# Altium project ESP8266-Deskop_Power.PrjPcb (part 1 of 2)
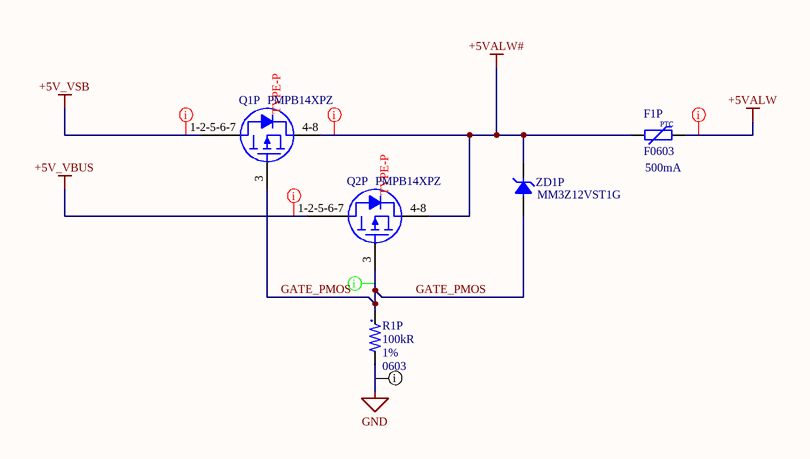
[diagram p0: 1_Power_Path.SchDoc]
10 sheets, 64 parts. Net scope: flat (ports and power ports of the same name join across sheets).
Board file: ESP8266-Deskop_Power.PcbDoc
Sheets:
  1_Power_Path.SchDoc
  2_LDO.SchDoc
  3_ESP8266_Core.SchDoc
  4_UART.SchDoc
  5_Keys_And_Status.SchDoc
  6_I2C_Sensors.SchDoc
  7_Mosfets.SchDoc
  8_Front_Pannel_Con.SchDoc
  9_Front_Pannel_USB_Con.SchDoc
  10_MountingHoles.SchDoc

## Sheet 1_Power_Path.SchDoc: Power_Path
size A4; ApprovedBy: Alcatraz; CheckedBy: Alcatraz; Author: Alcatraz; CompanyName: DHNLAB; DrawnBy: Alcatraz; Engineer: Alcatraz; Organization: DHNLAB PVT LTD; Address1: DHANBAD; Address2: JHARKHAND; Address3: INDIA; Address4: ASIA; DocumentNumber: 1; Revision: 1.0; SheetNumber: 1; SheetTotal: 10; ProjectTitle: ESP8266-Deskop_Power

### Parts
F1P  F0603  value 500mA  [R0603-IPC_C]
Q1P  PMPB14XPZ  [DFN2020MD-MFG]
Q2P  PMPB14XPZ  [DFN2020MD-MFG]
R1P  value 100kR  Tolerance: 1%  Case/Package: 0603  [R0603-MFG]  (hidden comment: AC0603FR-07100KL)
ZD1P  MM3Z12VST1G  [SOD-323]

### Nets
+5V_VBUS: Q2P.1-2-5-6-7(D)
+5V_VSB: Q1P.1-2-5-6-7(D)
+5VALW: F1P.2
+5VALW#: F1P.1 Q1P.4-8(S) Q2P.4-8(S) ZD1P.1(C)
GND: R1P.2
GATE_PMOS: Q1P.3(G) Q2P.3(G) R1P.1 ZD1P.2(A)

### Layout directives
net class Power; net class PowerRails_LowVoltage_DC: +5V_VBUS, +5V_VSB, +5VALW, +5VALW#
net class Digital_Signal_Low_Speed; net class Signal: GATE_PMOS
net class GND; net class PowerRails_GND: GND

### Notes on the sheet
- Title:
- Author:
- Approved:
- Size:
- Date:
- Git Hash:
- A4
- Prj:
- SW Version:
- Variant:
- Edited:
- PUBLIC
- File:
- (in symbol FUSE_PPTC_0603) PTC
- (in symbol PMPB14XPZ) TYPE-P

### Library data of the parts
F1P = FUSE_PPTC_0603: Fuse PPTC SMD 0603; Manufacturer: *; Manufacturer Part Number: *
Q1P Q2P = PMPB14XPZ: Manufacturer: Nexperia; Supplier 1: Element14; Supplier Part Number 1: 4177131; Manufacturer Part Number: PMPB14XPZ; RoHS: No; Stock 1: 3000
R1P = 100K: SMD Chip Resistor, 100 kOhm, ± 1%, 100 mW, 0603 [1608 Metric], Thick Film, General Purpose; Manufacturer: Yageo; Power Rating: 100mW; Temperature Coefficient: 100ppm/°C; Voltage Rating: 50V; Working Voltage: 75V; Supplier 1: Future Electronics; Manufacturer Part Number: AC0603FR-07100KL; RoHS: Yes; Category: Chip SMD Resistors; Stock 1: 3790000; Pricing 1: 5000=0.0034, 25000=0.0018, 75000=0.0032, 125000=0.0017, 250000=0.0031, 750000=0.003, 2500000=0.0027 (USD); Case Code (Imperial): 0603; Case Code (Metric): 1608; Min Operating Temperature: -55°C; Max Operating Temperature: 155°C; Packaging: Tape and Reel; Series: AC; Termination: SMD/SMT; Construction: Rectangular; Length: 1.6mm; Depth: 0.8mm; RoHS Compliant: Yes; Military Standard: Not; Lead Free: 5697LeadFree; Supplier Part Number 1: 6029288; Max Power Dissipation: 100mW; Features: Moisture Resistant,Automotive AEC-Q200; Number of Terminations: 2; Technology: THICK FILM; Moisture Sensitivity Level: 1; Ratings: AEC-Q200; ComponentLink1URL: https://datasheet.ciiva.com/26862/getdatasheetpartid-715379-26862460.pdf?src-supplier=Verical; ComponentLink1Description: https://datasheet.ciiva.com/26862/getdatasheetpartid-715379-26862460.pdf?src-supplier=Verical; ComponentLink2URL: https://datasheet.ciiva.com/5562/pyu-ac-51-rohs-l-2-5562536.pdf?src-supplier=Mouser; ComponentLink2Description: https://datasheet.ciiva.com/5562/pyu-ac-51-rohs-l-2-5562536.pdf?src-supplier=Mouser
ZD1P = MM3Z12VST1G: MM3Z12VST1G Zener Diode, 12V 2% 200 mW SMT 2-Pin SOD-323 | ON Semiconductor MM3Z12VST1G; Max Power Dissipation: 300mW; Impedance: 25R; Power Dissipation: 200mW; Max Reverse Leakage Current: 100nA; Test Current: 5mA; Forward Voltage: 900mV; Zener Current: 10mA; Supplier 1: Onlinecomponents.com; Supplier Part Number 1: MM3Z12VST1G; Manufacturer: ON Semiconductor; Manufacturer Part Number: MM3Z12VST1G; RoHS: Yes; Category: Zener Diodes; Stock 1: 60000; Pricing 1: 3000=0.0152, 6000=0.0145, 9000=0.0143, 27000=0.0137, 51000=0.0133, 102000=0.0128, 252000=0.0125, 501000=0.0123 (USD); Case/Package: SOD-323-2; Min Operating Temperature: -65°C; Max Operating Temperature: 150°C; Packaging: Tape and Reel; Package Quantity: 3000; Zener Voltage: 12V; Voltage Tolerance: 2%; Tolerance: 2%; Series: -; RoHS Compliant: Yes; ComponentLink1URL: https://datasheet.ciiva.com/30478/0900766b8127c8bd-30478408.pdf?src-supplier=Rs; ComponentLink1Description: https://datasheet.ciiva.com/30478/0900766b8127c8bd-30478408.pdf?src-supplier=Rs; ComponentLink2URL: https://datasheet.ciiva.com/16292/mm3z12vst1g-16292931.pdf?src-supplier=Future+Electronics; ComponentLink2Description: https://datasheet.ciiva.com/16292/mm3z12vst1g-16292931.pdf?src-supplier=Future+Electronics; ComponentLink3URL: https://datasheet.ciiva.com/22626/1878251-22626885.pdf?src-supplier=Element14; ComponentLink3Description: https://datasheet.ciiva.com/22626/1878251-22626885.pdf?src-supplier=Element14; Pins: 2; Material: Plastic; Working Voltage: 12V; Max Reverse Current: 100nA; Voltage Rating (DC): 12V; Power Rating: 200mW; Length: 1.8mm; Width: 1.35mm; Height: 1mm; Radiation Hardening: No; Lead Free: Lead Free; Reach SVHC Compliant: No; ComponentLink4URL: https://datasheet.ciiva.com/894/mm3z2v4st1-d-894650.pdf?src-supplier=Digikey; ComponentLink4Description: https://datasheet.ciiva.com/894/mm3z2v4st1-d-894650.pdf?src-supplier=Digikey; ComponentLink5URL: https://datasheet.ciiva.com/894/mm3z2v4st1-d-894651.pdf?src-supplier=Digikey; ComponentLink5Description: https://datasheet.ciiva.com/894/mm3z2v4st1-d-894651.pdf?src-supplier=Digikey; ComponentLink6URL: https://datasheet.ciiva.com/894/mm3z2v4st1-d-894649.pdf?src-supplier=Digikey; ComponentLink6Description: https://datasheet.ciiva.com/894/mm3z2v4st1-d-894649.pdf?src-supplier=Digikey

## Sheet 2_LDO.SchDoc: LDO
size A4; ApprovedBy: Alcatraz; CheckedBy: Alcatraz; Author: Alcatraz; CompanyName: DHNLAB; DrawnBy: Alcatraz; Engineer: Alcatraz; Organization: DHNLAB PVT LTD; Address1: DHANBAD; Address2: JHARKHAND; Address3: INDIA; Address4: ASIA; DocumentNumber: 2; Revision: 1.0; SheetNumber: 2; SheetTotal: 10; ProjectTitle: ESP8266-Deskop_Power
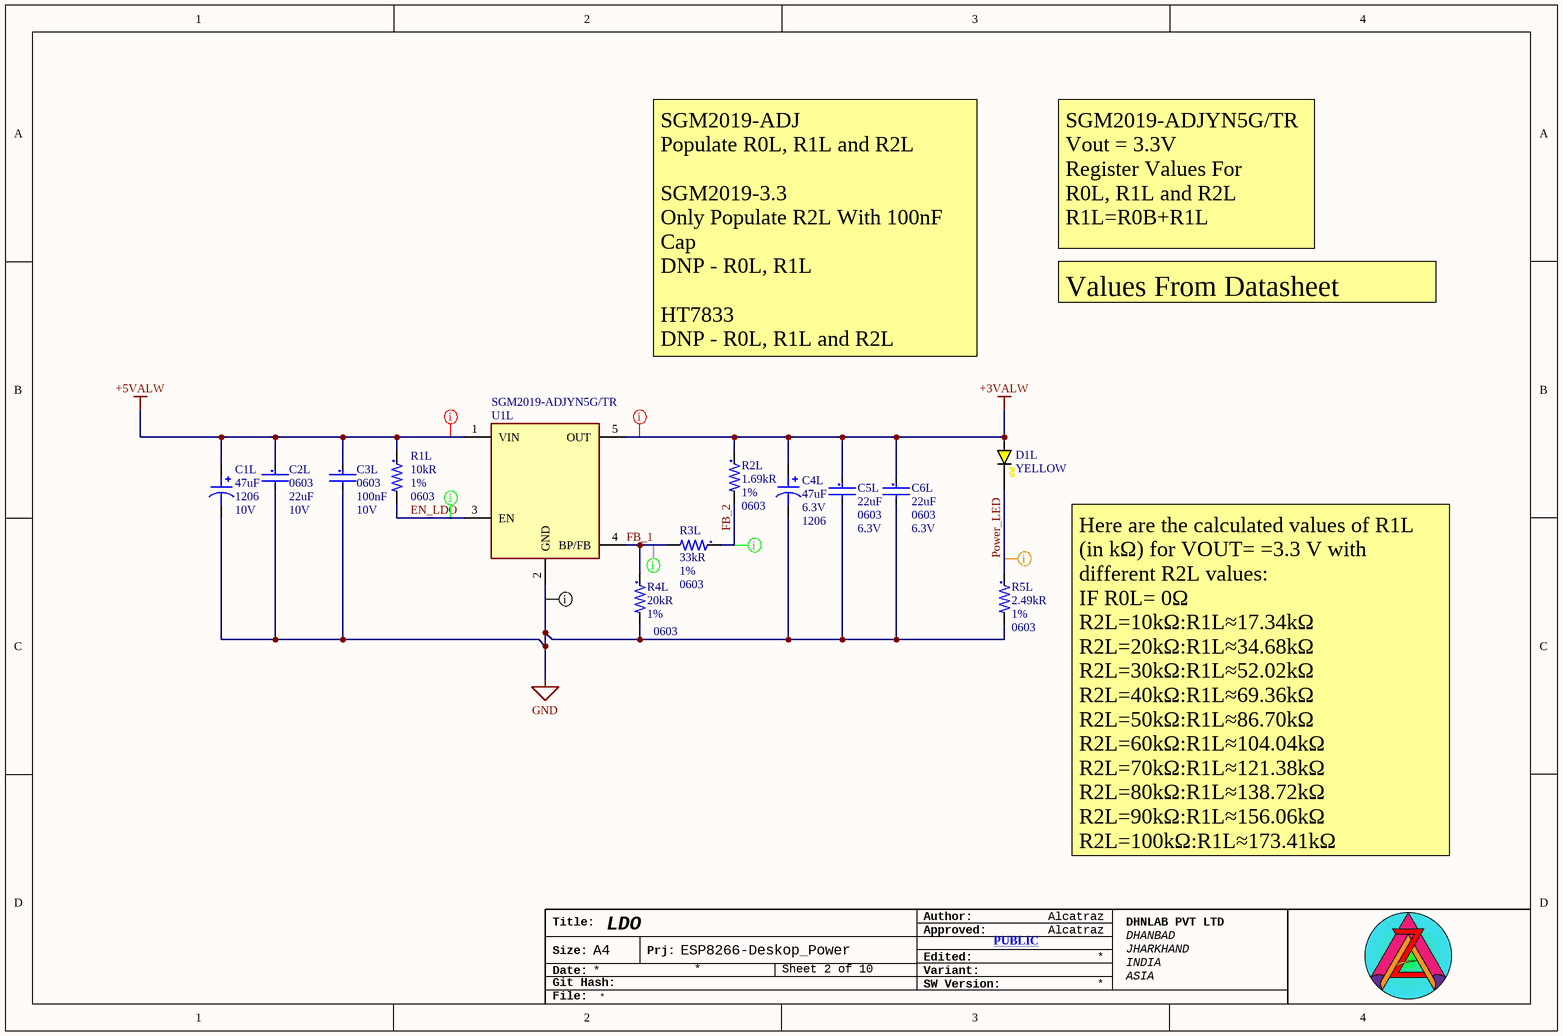
[diagram p1: 2_LDO.SchDoc]

### Parts
C1L  value 47uF  Case/Package: 1206  Voltage Rating (DC): 10V  [CAP POL 1206_3216-MFG]  (hidden comment: TCTAL1A476M8R)
C2L  value 22uF  Case/Package: 0603  Voltage Rating: 10V  [C0603-IPC_C_No_Silk]  (hidden comment: GRM188R61A226ME15D)
C3L  value 100nF  Case/Package: 0603  Voltage Rating: 10V  [C0603-IPC_C_No_Silk]  (hidden comment: C0603C104K8RACTU)
C4L  value 47uF  Voltage: 6.3V  Size: 1206  [CAP POL 1206_3216-MFG]  (hidden comment: T491A476M006AT)
C5L  value 22uF  Case/Package: 0603  Voltage Rating: 6.3V  [C0603-IPC_C_No_Silk]  (hidden comment: GRM188R60J226MEA0D)
C6L  value 22uF  Case/Package: 0603  Voltage Rating: 6.3V  [C0603-IPC_C_No_Silk]  (hidden comment: GRM188R60J226MEA0D)
D1L  YELLOW  [LED_0603_YELLOW]
R1L  value 10kR  Tolerance: 1%  Case/Package: 0603  [R0603-MFG]  (hidden comment: RC0603FR-0710KL)
R2L  value 1.69kR  Tolerance: 1%  Case/Package: 0603  [R0603-MFG]  (hidden comment: MCR03EZPFX1691)
R3L  value 33kR  Tolerance: 1%  Case/Package: 0603  [R0603-MFG]  (hidden comment: ERJ-3EKF3302V)
R4L  value 20kR  Tolerance: 1%  Case/Package: 0603  [R0603-MFG]  (hidden comment: CR0603-FX-2002ELF)
R5L  value 2.49kR  Tolerance: 1%  Case/Package: 0603  [R0603-MFG]  (hidden comment: MCR03EZPFX2491)
U1L  SGM2019-ADJYN5G/TR  [TSOT-23-5-IPC-A]

### Nets
+3VALW: C4L.1 C5L.1 C6L.1 D1L.2(A) R2L.1 U1L.5(OUT)
+5VALW: C1L.1 C2L.1 C3L.1 R1L.1 U1L.1(VIN)
GND: C1L.2 C2L.2 C3L.2 C4L.2 C5L.2 C6L.2 R4L.2 R5L.2 U1L.2(GND)
EN_LDO: R1L.2 U1L.3(EN)
FB_1: R3L.2 R4L.1 U1L.4(BP/FB)
FB_2: R2L.2 R3L.1
Power_LED: D1L.1(K) R5L.1

### Layout directives
net class GND; net class PowerRails_GND: GND
net class Power; net class PowerRails_LowVoltage_DC; net class Power_Signal: Power_LED
net class Digital_Signal_Low_Speed; net class Signal: EN_LDO, FB_1, FB_2
net class Power; net class PowerRails_LowVoltage_DC: +3VALW, +5VALW

### Notes on the sheet
- SGM2019-ADJYN5G/TR
  Vout = 3.3V
  Register Values For
  R0L, R1L and R2L
  R1L=R0B+R1L
- Values From Datasheet
- SGM2019-ADJ
  Populate R0L, R1L and R2L
  SGM2019-3.3
  Only Populate R2L With 100nF Cap
  DNP - R0L, R1L
  HT7833
  DNP - R0L, R1L and R2L
- Here are the calculated values of R1L (in kΩ) for VOUT= =3.3 V with different R2L values:
  IF R0L= 0Ω
  R2L=10kΩ:R1L≈17.34kΩ
  R2L=20kΩ:R1L≈34.68kΩ
  R2L=30kΩ:R1L≈52.02kΩ
  R2L=40kΩ:R1L≈69.36kΩ
  R2L=50kΩ:R1L≈86.70kΩ
  R2L=60kΩ:R1L≈104.04kΩ
  R2L=70kΩ:R1L≈121.38kΩ
  R2L=80kΩ:R1L≈138.72kΩ
  R2L=90kΩ:R1L≈156.06kΩ
  R2L=100kΩ:R1L≈173.41kΩ
- Title:
- Author:
- Approved:
- Size:
- Date:
- Git Hash:
- A4
- Prj:
- SW Version:
- Variant:
- Edited:
- PUBLIC
- File:

### Library data of the parts
C1L = 47uF_10V: Surface Mount Tantalum Capacitor, 47 uF, 10 V, ± 20%, -55 °C, 125 °C, 1206 [3216-12 Metric]; Manufacturer: Rohm; Supplier 1: Ameya360; RoHS: Yes; Category: Tantalum Capacitors; ComponentLink1URL: https://datasheet.ciiva.com/258/tct-al-258880.pdf?src-supplier=Digikey; ComponentLink1Description: https://datasheet.ciiva.com/258/tct-al-258880.pdf?src-supplier=Digikey; ComponentLink2URL: https://datasheet.ciiva.com/258/tct-al-258881.pdf?src-supplier=Digikey; ComponentLink2Description: https://datasheet.ciiva.com/258/tct-al-258881.pdf?src-supplier=Digikey; ComponentLink3URL: https://datasheet.ciiva.com/258/tct-al-258879.pdf?src-supplier=Digikey; ComponentLink3Description: https://datasheet.ciiva.com/258/tct-al-258879.pdf?src-supplier=Digikey; ComponentLink4URL: https://datasheet.ciiva.com/16394/tct-al-16394319.pdf?src-supplier=Future+Electronics; ComponentLink4Description: https://datasheet.ciiva.com/16394/tct-al-16394319.pdf?src-supplier=Future+Electronics; Manufacturer Part Number: TCTAL1A476M8R; Stock 1: 250; Pricing 1: 1=0.82, 10=0.622 (USD); Supplier Part Number 1: TCTAL1A476M8R; Mounting Technology: Surface Mount; Case Code (Metric): 3216; Case Code (Imperial): 1206; Min Operating Temperature: -55°C; Max Operating Temperature: 125°C; Tolerance: 20%; Packaging: Cut Tape; Voltage Rating: 10V; Series: TCT; Features: General Purpose; Construction: Flat; Length: 3.2mm; Height: 1.1mm; Depth: 1.6mm; Radiation Hardening: No; RoHS Compliant: Yes; Lead Free: Lead Free
C2L = 22uF_10V: Multilayer Ceramic Capacitor, 22 uF, 10 V, ± 20%, X5R, 0603 [1608 Metric]; Manufacturer: Murata; Supplier 1: Mouser; Manufacturer Part Number: GRM188R61A226ME15D; RoHS: Yes; Category: Ceramic Capacitors; Pricing 1: 1=0.2, 10=0.088, 50=0.088, 100=0.051, 1000=0.041, 10000=0.037 (USD); Mounting Technology: Surface Mount; Case Code (Imperial): 0603; Case Code (Metric): 1608; Min Operating Temperature: -55°C; Max Operating Temperature: 85°C; Packaging: Cut Tape; Dielectric: X5R; Package Quantity: 4000; Series: GRM; Termination: SMD/SMT; Voltage Rating (DC): 10V; Length: 1.6mm; Width: 0.8mm; Height: 0.8mm; RoHS Compliant: Yes; Lead Free: 5697LeadFree; ComponentLink1URL: https://datasheet.ciiva.com/46444/1769893-46444975.pdf?src-supplier=Element14; ComponentLink1Description: https://datasheet.ciiva.com/46444/1769893-46444975.pdf?src-supplier=Element14; Supplier Part Number 1: 81-GRM188R61A226ME5D; Tolerance: 20%; Stock 1: 596743; Material: Ceramic; Weight: 0.000222oz; Thickness: 0.039inch; Reach SVHC Compliant: No
C3L = 100nF_10V: Multilayer Ceramic Capacitor, 0.1 uF, 10 V, ± 10%, X7R, 0603 [1608 Metric]; Manufacturer: KEMET; Material: 4241ConductorMaterial; Dissipation Factor: 5%; Temperature Coefficient: 30ppm/°C; Supplier 1: Mouser; Manufacturer Part Number: C0603C104K8RACTU; RoHS: Yes; Category: Ceramic Capacitors; Pricing 1: 1=0.11, 10=0.075, 50=0.075, 100=0.036, 1000=0.021, 10000=0.017 (USD); Mounting Technology: Surface Mount,PCB; Case Code (Imperial): 0603; Case Code (Metric): 1608; Min Operating Temperature: -55°C; Max Operating Temperature: 125°C; Packaging: Tape and Reel; Dielectric: X7R; Package Quantity: 1; Series: C; Termination: SMD/SMT; Voltage Rating (DC): 10V; Length: 1.6mm; Width: 0.031inch; Height: 0.8mm; RoHS Compliant: Yes; Lead Free: 5697LeadFree; ComponentLink1URL: https://datasheet.ciiva.com/6093/1776114-6093269.pdf?src-supplier=Farnell; ComponentLink1Description: https://datasheet.ciiva.com/6093/1776114-6093269.pdf?src-supplier=Farnell; Supplier Part Number 1: 80-C0603C104K8R; Tolerance: 10%; Stock 1: 246409; Thickness: 0.034inch; Reach SVHC Compliant: No; Pins: 2; Dielectric Material: Ceramic; Voltage: 10V; Construction: Flat; Depth: 0.8mm; ComponentLink2URL: https://datasheet.ciiva.com/7823/kem-c1002-x7r-smd-7823989.pdf?src-supplier=Element14; ComponentLink2Description: https://datasheet.ciiva.com/7823/kem-c1002-x7r-smd-7823989.pdf?src-supplier=Element14; ComponentLink3URL: https://datasheet.ciiva.com/22693/1851736-22693967.pdf?src-supplier=Element14; ComponentLink3Description: https://datasheet.ciiva.com/22693/1851736-22693967.pdf?src-supplier=Element14; ComponentLink4URL: https://datasheet.ciiva.com/14589/70095383-14589402.pdf?src-supplier=Allied+Electronics; ComponentLink4Description: https://datasheet.ciiva.com/14589/70095383-14589402.pdf?src-supplier=Allied+Electronics; ComponentLink5URL: https://datasheet.ciiva.com/14593/70095383-14593978.pdf?src-supplier=Allied+Electronics; ComponentLink5Description: https://datasheet.ciiva.com/14593/70095383-14593978.pdf?src-supplier=Allied+Electronics; ComponentLink6URL: https://datasheet.ciiva.com/5419/kem-c1002-x7r-smd-357932-5419657.pdf?src-supplier=Mouser; ComponentLink6Description: https://datasheet.ciiva.com/5419/kem-c1002-x7r-smd-357932-5419657.pdf?src-supplier=Mouser; ComponentLink7URL: https://datasheet.ciiva.com/18192/getdatasheetpartid-91529-18192711.pdf?src-supplier=Verical; ComponentLink7Description: https://datasheet.ciiva.com/18192/getdatasheetpartid-91529-18192711.pdf?src-supplier=Verical; Lead Pitch: 0.7mm; Radiation Hardening: No
C4L = 47uF_6.3V: 47uF Solid MnO2 Tantalum Electrolytic Capacitor; 6.3 V dc +/-20%; T491 Series; Manufacturer: KEMET; Supplier 1: Mouser; RoHS: Yes; Category: Tantalum Capacitors; ComponentLink1URL: https://datasheet.ciiva.com/18096/getdatasheetpartid-132583-18096186.pdf?src-supplier=Verical; ComponentLink1Description: https://datasheet.ciiva.com/18096/getdatasheetpartid-132583-18096186.pdf?src-supplier=Verical; ComponentLink2URL: https://datasheet.ciiva.com/258/kem-t2005-t491-258163.pdf?src-supplier=Digikey; ComponentLink2Description: https://datasheet.ciiva.com/258/kem-t2005-t491-258163.pdf?src-supplier=Digikey; ComponentLink3URL: https://datasheet.ciiva.com/258/kem-t2005-t491-258164.pdf?src-supplier=Digikey; ComponentLink3Description: https://datasheet.ciiva.com/258/kem-t2005-t491-258164.pdf?src-supplier=Digikey; ComponentLink4URL: https://datasheet.ciiva.com/258/kem-t2005-t491-258165.pdf?src-supplier=Digikey; ComponentLink4Description: https://datasheet.ciiva.com/258/kem-t2005-t491-258165.pdf?src-supplier=Digikey; ComponentLink5URL: https://datasheet.ciiva.com/12883/kem-t2005-t491-12883464.pdf?src-supplier=Mouser; ComponentLink5Description: https://datasheet.ciiva.com/12883/kem-t2005-t491-12883464.pdf?src-supplier=Mouser; ComponentLink6URL: https://datasheet.ciiva.com/14103/t491serie-eng-tds-14103966.pdf?src-supplier=Distrelec; ComponentLink6Description: https://datasheet.ciiva.com/14103/t491serie-eng-tds-14103966.pdf?src-supplier=Distrelec; ComponentLink7URL: https://datasheet.ciiva.com/28561/kem-t2005-t491-28561180.pdf?src-supplier=Element14; ComponentLink7Description: https://datasheet.ciiva.com/28561/kem-t2005-t491-28561180.pdf?src-supplier=Element14; ComponentLink8URL: https://datasheet.ciiva.com/7851/1854511-7851173.pdf?src-supplier=Element14; ComponentLink8Description: https://datasheet.ciiva.com/7851/1854511-7851173.pdf?src-supplier=Element14; ComponentLink9URL: https://datasheet.ciiva.com/7851/1854511-7851174.pdf?src-supplier=Element14; ComponentLink9Description: https://datasheet.ciiva.com/7851/1854511-7851174.pdf?src-supplier=Element14; Manufacturer Part Number: T491A476M006AT; Stock 1: 52790; Pricing 1: 1=0.58, 10=0.394, 50=0.394, 100=0.259, 1000=0.172, 10000=0.139 (USD); Supplier Part Number 1: 80-T491A476M06
C5L C6L = 22uF_6.3V: Multilayer Ceramic Capacitor, 22 uF, 6.3 V, ± 20%, X5R, 0603 [1608 Metric]; Manufacturer: Murata; Material: 4241ConductorMaterial; Supplier 1: Mouser; Manufacturer Part Number: GRM188R60J226MEA0D; RoHS: Yes; Category: Ceramic Capacitors; Stock 1: 856547; Pricing 1: 1=0.2, 10=0.078, 50=0.078, 100=0.045, 1000=0.04, 10000=0.033 (USD); Mounting Technology: Surface Mount; Pins: 2NUMBER; Case Code (Metric): 1608; Weight: 0.000222oz; Min Operating Temperature: -55°C; Max Operating Temperature: 85°C; Tolerance: 20%; Series: GRM; Packaging: Tape and Reel; Dielectric: X5R; Voltage Rating (DC): 6.3V; Package Quantity: 1; Termination: SMD/SMT; Length: 0.063inch; Width: 0.031inch; Height: 0.8mm; Thickness: 0.039inch; RoHS Compliant: Yes; Reach SVHC Compliant: No; Lead Free: 5697LeadFree; ComponentLink1URL: https://datasheet.ciiva.com/29540/partnumbering-e-01-29540442.pdf?src-supplier=Digikey; ComponentLink1Description: https://datasheet.ciiva.com/29540/partnumbering-e-01-29540442.pdf?src-supplier=Digikey; ComponentLink2URL: https://datasheet.ciiva.com/29540/partnumbering-e-01-29540441.pdf?src-supplier=Digikey; ComponentLink2Description: https://datasheet.ciiva.com/29540/partnumbering-e-01-29540441.pdf?src-supplier=Digikey; ComponentLink3URL: https://datasheet.ciiva.com/29540/partnumbering-e-01-29540443.pdf?src-supplier=Digikey; ComponentLink3Description: https://datasheet.ciiva.com/29540/partnumbering-e-01-29540443.pdf?src-supplier=Digikey; Supplier Part Number 1: 81-GRM188R60J226ME0D; Case Code (Imperial): 0603
D1L = LED_0603_YELLOW: LED 0603 YELLOW SMD
R1L = 10K: SMD Chip Resistor, 10 kOhm, ± 1%, 100 mW, 0603 [1608 Metric], Thick Film, General Purpose; Manufacturer: Yageo; Power Rating: 100mW; Temperature Coefficient: 100ppm/°C; Voltage Rating (DC): 50V; Voltage Rating: 75V; Supplier 1: Future Electronics; Manufacturer Part Number: RC0603FR-0710KL; RoHS: Yes; Category: Chip SMD Resistors; Stock 1: 44660000; Pricing 1: 5000=0.0015, 50000=0.0014, 150000=0.0014, 375000=0.0013, 1000000=0.0012 (USD); Case Code (Imperial): 0603; Case Code (Metric): 1608; Min Operating Temperature: -55°C; Max Operating Temperature: 155°C; Packaging: Tape and Reel; Number of Terminations: 2; Max Power Dissipation: 100mW; Features: Moisture Resistant; Series: RC; Lead Free: 5697LeadFree; RoHS Compliant: Yes; Supplier Part Number 1: 4023214; Length: 1.6mm; Width: 0.8mm; Height: 0.45mm; Pins: 2; Weight: 7.1E-05oz; Resistance Tolerance: 1%; Termination: SMD/SMT; Resistor Type: Thick Film; Construction: Rectangular; Depth: 0.8mm; Lead Pitch: 0.3mm; Reach SVHC Compliant: No; Military Standard: Not
R2L = 1.69K: Surface Mount Thick Film Chip Resistor 0603 Case 1.69K Ohms 1% Tolerance 100 PPM; Manufacturer: Rohm; Power Rating: 100mW; Temperature Coefficient: 100ppm/°C; Voltage Rating (DC): 50V; Supplier 1: Quest; Manufacturer Part Number: MCR03EZPFX1691; RoHS: Yes; Category: Chip SMD Resistors; Stock 1: 11347; Pricing 1: 1=0.0232, 217=0.0145, 1380=0.0087, 5748=0.0044 (USD); Case Code (Imperial): 0603; Case Code (Metric): 1608; Min Operating Temperature: -55°C; Max Operating Temperature: 155°C; Packaging: Cut Tape; Number of Terminations: 2; Max Power Dissipation: 100mW; Features: Automotive AEC-Q200; Series: MCR03; Lead Free: Lead Free; RoHS Compliant: Yes; Supplier Part Number 1: MCR03EZPFX1691; Package Quantity: 1; Length: 0.063inch; Width: 0.031inch; Height: 0.022inch; Mounting Technology: Surface Mount; ComponentLink1URL: http://rohmfs.rohm.com/en/products/databook/datasheet/passive/resistor/chip_resistor/mcr.pdf?src-supplier=Avnet; ComponentLink1Description: http://rohmfs.rohm.com/en/products/databook/datasheet/passive/resistor/chip_resistor/mcr.pdf?src-supplier=Avnet; ComponentLink2URL: http://www.rohm.com/web/global/datasheet/MCR03EZPFX/mcr-e?src-supplier=Digikey; ComponentLink2Description: http://www.rohm.com/web/global/datasheet/MCR03EZPFX/mcr-e?src-supplier=Digikey
R3L = 33K: Res Thick Film 0603 33K Ohm 1% 0.1W(1/10W) ±100ppm/C Pad SMD Automotive T/R; Manufacturer: Panasonic; Power Rating: 100mW; Temperature Coefficient: 100ppm/°C; Voltage Rating (DC): 75V; Supplier 1: Onlinecomponents.com; Manufacturer Part Number: ERJ-3EKF3302V; RoHS: Yes; Category: Chip SMD Resistors; Stock 1: 350000; Pricing 1: 5000=0.0041, 10000=0.0039, 20000=0.0037, 40000=0.0036, 50000=0.0035 (USD); Case Code (Imperial): 0603; Case Code (Metric): 1608; Min Operating Temperature: -55°C; Max Operating Temperature: 155°C; Packaging: Tape and Reel; Number of Terminations: 2; Max Power Dissipation: 100mW; Features: Automotive AEC-Q200; Series: ERJ; Lead Free: 5697LeadFree; RoHS Compliant: Yes; Supplier Part Number 1: ERJ3EKF3302V; Mounting Technology: Surface Mount; Contact Plating: Tin; Package Quantity: 1; Length: 1.6mm; Width: 0.8mm; Height: 0.022inch; Pins: 2; Voltage Rating: 75V; Termination: SMD/SMT; Construction: Rectangular; Resistor Type: Thick Film; Resistance Tolerance: 1%; Depth: 0.8mm; Radiation Hardening: No; Military Standard: Not; Reach SVHC Compliant: No
R4L = 20K: SMD Chip Resistor, 20 kOhm, ± 1%, 100 mW, 0603 [1608 Metric], Thick Film, General Purpose; Manufacturer: Bourns; Power Rating: 100mW; Temperature Coefficient: 100ppm/°C; Voltage Rating (DC): 50V; Supplier 1: Onlinecomponents.com; Manufacturer Part Number: CR0603-FX-2002ELF; RoHS: Yes; Category: Chip SMD Resistors; Stock 1: 20000; Pricing 1: 20000=0.0014, 40000=0.0013, 80000=0.0013, 160000=0.0012 (USD); Case Code (Imperial): 0603; Case Code (Metric): 1608; Min Operating Temperature: -55°C; Max Operating Temperature: 155°C; Packaging: Tape and Reel; Number of Terminations: 2; Max Power Dissipation: 100mW; Features: Moisture Resistant; Series: CR0603; RoHS Compliant: Yes; ComponentLink1URL: https://datasheet.ciiva.com/11809/0900766b80fcdb72-11809666.pdf?src-supplier=Rs; ComponentLink1Description: https://datasheet.ciiva.com/11809/0900766b80fcdb72-11809666.pdf?src-supplier=Rs; ComponentLink2URL: https://datasheet.ciiva.com/9121/chpreztr-9121928.pdf?src-supplier=Avnet; ComponentLink2Description: https://datasheet.ciiva.com/9121/chpreztr-9121928.pdf?src-supplier=Avnet; Supplier Part Number 1: CR0603-FX-2002ELF; Mounting Technology: Surface Mount; Contact Plating: Tin; Package Quantity: 1; Length: 1.6mm; Width: 0.8mm; Height: 0.45mm; Voltage Rating: 50V; Resistor Type: Thick Film; Termination: SMD/SMT; Resistance Tolerance: 1%; Technology: THICK FILM; Depth: 0.8mm; Thickness: 457um; Radiation Hardening: No; Reach SVHC Compliant: No
R5L = 2.49K: Res Thick Film 0603 2.49K Ohm 1% 1/10W ±100ppm/°C Molded SMD SMD Paper T/R; Manufacturer: Rohm; Power Rating: 100mW; Voltage Rating (DC): 50V; Supplier 1: One Stop Electro; Manufacturer Part Number: MCR03EZPFX2491; RoHS: Yes; Category: Chip SMD Resistors; Stock 1: 683; Pricing 1: 1=0.036, 10=0.031, 100=0.031, 1000=0.028 (USD); Case Code (Imperial): 0603; Case Code (Metric): 1608; Min Operating Temperature: -55°C; Max Operating Temperature: 155°C; Packaging: Cut Tape; Number of Terminations: 2; Temperature Coefficient: 100ppm/°C; Max Power Dissipation: 100mW; Features: Automotive AEC-Q200; Series: MCR03; Lead Free: Lead Free; RoHS Compliant: Yes; ComponentLink1URL: https://datasheet.ciiva.com/2520/mcr-2520347.pdf?src-supplier=Digikey; ComponentLink1Description: https://datasheet.ciiva.com/2520/mcr-2520347.pdf?src-supplier=Digikey; ComponentLink2URL: https://datasheet.ciiva.com/2520/mcr-2520348.pdf?src-supplier=Digikey; ComponentLink2Description: https://datasheet.ciiva.com/2520/mcr-2520348.pdf?src-supplier=Digikey; ComponentLink3URL: https://datasheet.ciiva.com/2520/mcr-2520349.pdf?src-supplier=Digikey; ComponentLink3Description: https://datasheet.ciiva.com/2520/mcr-2520349.pdf?src-supplier=Digikey; ComponentLink4URL: https://datasheet.ciiva.com/16203/mcr03ezpd-16203167.pdf?src-supplier=Future+Electronics; ComponentLink4Description: https://datasheet.ciiva.com/16203/mcr03ezpd-16203167.pdf?src-supplier=Future+Electronics; Supplier Part Number 1: 53268691; Mounting Technology: Surface Mount; Contact Plating: Tin; Package Quantity: 1; Length: 0.063inch; Width: 0.031inch; Height: 0.022inch
U1L = SGM2019-ADJYN5G/TR: LDO U-Reg Adj 0, 3A SOT23-5; Manufacturer: SG Micro; Supplier 1: Sourcengine; Supplier Part Number 1: SGM2019-ADJYN5GTR-112944978; Manufacturer Part Number: SGM2019-ADJYN5G/TR; RoHS: No; Category: LDO; Stock 1: 6915

## Sheet 3_ESP8266_Core.SchDoc: ESP8266_Core
size A4; ApprovedBy: Alcatraz; CheckedBy: Alcatraz; Author: Alcatraz; CompanyName: DHNLAB; DrawnBy: Alcatraz; Engineer: Alcatraz; Organization: DHNLAB PVT LTD; Address1: DHANBAD; Address2: JHARKHAND; Address3: INDIA; Address4: ASIA; DocumentNumber: 3; Revision: 1.0; SheetNumber: 3; SheetTotal: 10; ProjectTitle: ESP8266-Deskop_Power
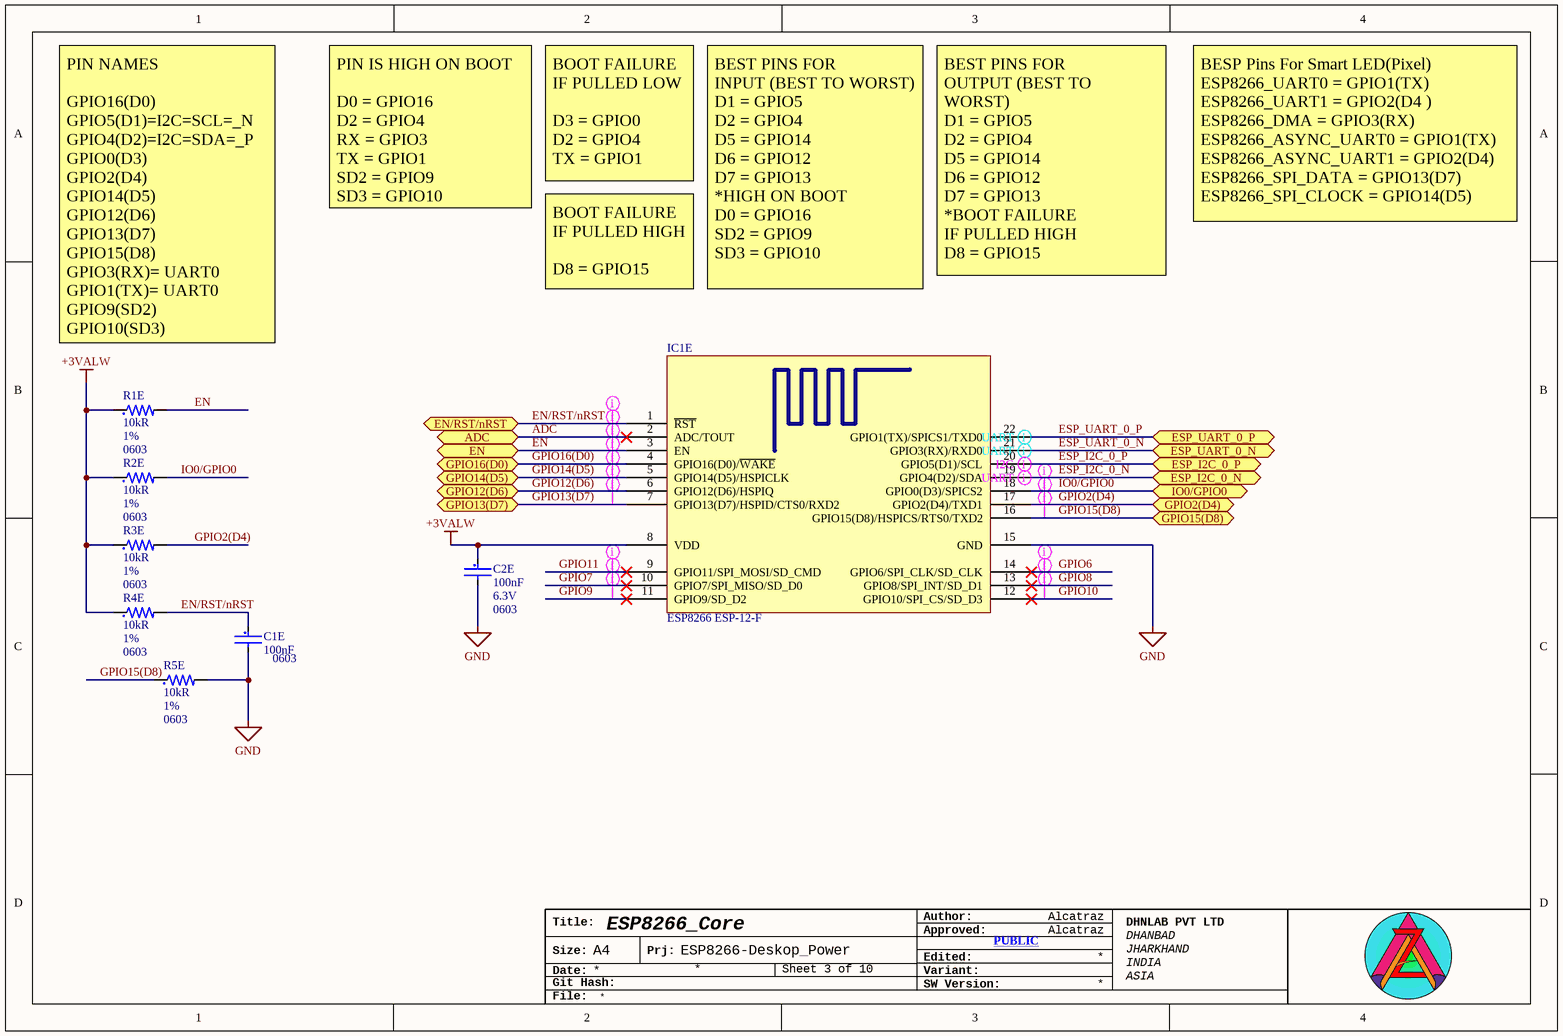
[diagram p2: 3_ESP8266_Core.SchDoc]

### Parts
C1E  value 100nF  Package: 0603  [C0603-IPC_C_No_Silk]  (hidden comment: KGM15AR70J104KM)
C2E  value 100nF  Voltage: 6.3V  Package: 0603  [C0603-IPC_C_No_Silk]  (hidden comment: KGM15AR70J104KM)
IC1E  ESP8266 ESP-12-F  [ESP8266 ESP-12-Large]
R1E  value 10kR  Tolerance: 1%  Case/Package: 0603  [R0603-MFG]  (hidden comment: RC0603FR-0710KL)
R2E  value 10kR  Tolerance: 1%  Case/Package: 0603  [R0603-MFG]  (hidden comment: RC0603FR-0710KL)
R3E  value 10kR  Tolerance: 1%  Case/Package: 0603  [R0603-MFG]  (hidden comment: RC0603FR-0710KL)
R4E  value 10kR  Tolerance: 1%  Case/Package: 0603  [R0603-MFG]  (hidden comment: RC0603FR-0710KL)
R5E  value 10kR  Tolerance: 1%  Case/Package: 0603  [R0603-MFG]  (hidden comment: RC0603FR-0710KL)

### Ports
ADC (bidir, see 3_ESP8266_Core[4B]), EN (bidir, see 3_ESP8266_Core[4B]), EN/RST/nRST (bidir), ESP_I2C_0_N (bidir, see 4_ESP32-Core[1C], 9_I2C & I2S[2A], 9_I2C & I2S[2B]), ESP_I2C_0_P (bidir, see 4_ESP32-Core[1C], 9_I2C & I2S[2A], 9_I2C & I2S[2B]), ESP_UART_0_N (bidir, see 4_ESP32-Core[3B]), ESP_UART_0_P (bidir, see 4_ESP32-Core[3B]), GPIO2(D4) (bidir, see 3_ESP8266_Core[2B]), GPIO12(D6) (bidir, see 3_ESP8266_Core[4B]), GPIO13(D7) (bidir, see 3_ESP8266_Core[4B]), GPIO14(D5) (bidir, see 3_ESP8266_Core[4B]), GPIO15(D8) (bidir, see 3_ESP8266_Core[2B]), GPIO16(D0) (bidir, see 3_ESP8266_Core[4B]), IO0/GPIO0 (bidir)

### Nets
+3VALW: C2E.1 IC1E.8(VDD) R1E.1 R2E.1 R3E.1 R4E.1
GND: C1E.2 C2E.2 IC1E.15(GND) R5E.2
ADC: IC1E.2(ADC/TOUT) ; port ADC
EN: IC1E.3(EN) R1E.2 ; port EN
EN/RST/nRST: C1E.1 IC1E.1(~{RST}) R4E.2 ; port EN/RST/nRST
ESP_I2C_0_N: IC1E.19(GPIO4(D2)/SDA) ; port ESP_I2C_0_N
ESP_I2C_0_P: IC1E.20(GPIO5(D1)/SCL) ; port ESP_I2C_0_P
ESP_UART_0_N: IC1E.21(GPIO3(RX)/RXD0) ; port ESP_UART_0_N
ESP_UART_0_P: IC1E.22(GPIO1(TX)/SPICS1/TXD0) ; port ESP_UART_0_P
GPIO2(D4): IC1E.17(GPIO2(D4)/TXD1) R3E.2 ; port GPIO2(D4)
GPIO6: IC1E.14(GPIO6/SPI_CLK/SD_CLK)
GPIO7: IC1E.10(GPIO7/SPI_MISO/SD_D0)
GPIO8: IC1E.13(GPIO8/SPI_INT/SD_D1)
GPIO9: IC1E.11(GPIO9/SD_D2)
GPIO10: IC1E.12(GPIO10/SPI_CS/SD_D3)
GPIO11: IC1E.9(GPIO11/SPI_MOSI/SD_CMD)
GPIO12(D6): IC1E.6(GPIO12(D6)/HSPIQ) ; port GPIO12(D6)
GPIO13(D7): IC1E.7(GPIO13(D7)/HSPID/CTS0/RXD2) ; port GPIO13(D7)
GPIO14(D5): IC1E.5(GPIO14(D5)/HSPICLK) ; port GPIO14(D5)
GPIO15(D8): IC1E.16(GPIO15(D8)/HSPICS/RTS0/TXD2) R5E.1 ; port GPIO15(D8)
GPIO16(D0): IC1E.4(GPIO16(D0)/~{WAKE}) ; port GPIO16(D0)
IO0/GPIO0: IC1E.18(GPIO0(D3)/SPICS2) R2E.2 ; port IO0/GPIO0

### Layout directives
net class Digital_Signal_Low_Speed; net class Signal_75_ohm: ADC, EN, EN/RST/nRST, GPIO2(D4), GPIO6, GPIO7, GPIO8, GPIO9, GPIO10, GPIO11, GPIO12(D6), GPIO13(D7), GPIO14(D5), GPIO15(D8), GPIO16(D0), IO0/GPIO0
differential pair; differential pair class UART: ESP_UART_0_N, ESP_UART_0_P
differential pair; differential pair class I2C: ESP_I2C_0_N, ESP_I2C_0_P

### Notes on the sheet
- BOOT FAILURE
  IF PULLED LOW
  D3 = GPIO0
  D2 = GPIO4
  TX = GPIO1
- PIN IS HIGH ON BOOT
  D0 = GPIO16
  D2 = GPIO4
  RX = GPIO3
  TX = GPIO1
  SD2 = GPIO9
  SD3 = GPIO10
- BESP Pins For Smart LED(Pixel)
  ESP8266_UART0 = GPIO1(TX)
  ESP8266_UART1 = GPIO2(D4 )
  ESP8266_DMA = GPIO3(RX)
  ESP8266_ASYNC_UART0 = GPIO1(TX)
  ESP8266_ASYNC_UART1 = GPIO2(D4)
  ESP8266_SPI_DATA = GPIO13(D7)
  ESP8266_SPI_CLOCK = GPIO14(D5)
- BOOT FAILURE
  IF PULLED HIGH
  D8 = GPIO15
- BEST PINS FOR
  INPUT (BEST TO WORST)
  D1 = GPIO5
  D2 = GPIO4
  D5 = GPIO14
  D6 = GPIO12
  D7 = GPIO13
  *HIGH ON BOOT
  D0 = GPIO16
  SD2 = GPIO9
  SD3 = GPIO10
- BEST PINS FOR
  OUTPUT (BEST TO WORST)
  D1 = GPIO5
  D2 = GPIO4
  D5 = GPIO14
  D6 = GPIO12
  D7 = GPIO13
  *BOOT FAILURE
  IF PULLED HIGH
  D8 = GPIO15
- PIN NAMES
  GPIO16(D0)
  GPIO5(D1)=I2C=SCL=_N
  GPIO4(D2)=I2C=SDA=_P
  GPIO0(D3)
  GPIO2(D4)
  GPIO14(D5)
  GPIO12(D6)
  GPIO13(D7)
  GPIO15(D8)
  GPIO3(RX)= UART0
  GPIO1(TX)= UART0
  GPIO9(SD2)
  GPIO10(SD3)
- Title:
- Author:
- Approved:
- Size:
- Date:
- Git Hash:
- A4
- Prj:
- SW Version:
- Variant:
- Edited:
- PUBLIC
- File:

### Library data of the parts
C1E C2E = 100nF_6.3V: Cap Cer 0.1UF 6.3V X7R 0603; Manufacturer: KYOCERA AVX; Tol: 10%; Supplier 1: Digikey; Supplier Part Number 1: 478-KGM15AR70J104KMCT-ND; Manufacturer Part Number: KGM15AR70J104KM; Category: Ceramic Capacitors; Stock 1: 117167; Pricing 1: 1=0.1, 10=0.032, 50=0.0186, 100=0.0144, 500=0.01082, 1000=0.0085, 2500=0.00772, 5000=0.00711 (USD)
  C1E: Voltage: 6.3V
R1E R2E R3E R4E R5E = 10K: as R1L on sheet 2_LDO; Supplier 1: Future Electronics; Manufacturer Part Number: RC0603FR-0710KL; RoHS: Yes; Category: Chip SMD Resistors; Stock 1: 44660000; Pricing 1: 5000=0.0015, 50000=0.0014, 150000=0.0014, 375000=0.0013, 1000000=0.0012 (USD); Case Code (Imperial): 0603; Case Code (Metric): 1608; Min Operating Temperature: -55°C; Max Operating Temperature: 155°C; Packaging: Tape and Reel; Series: RC; Termination: SMD/SMT; Construction: Rectangular; Length: 1.6mm; Width: 0.8mm; Height: 0.45mm; Depth: 0.8mm; RoHS Compliant: Yes; Military Standard: Not; Lead Free: 5697LeadFree; Supplier Part Number 1: 4023214; Pins: 2; Weight: 7.1E-05oz; Resistance Tolerance: 1%; Resistor Type: Thick Film; Max Power Dissipation: 100mW; Features: Moisture Resistant; Number of Terminations: 2; Lead Pitch: 0.3mm; Reach SVHC Compliant: No

## Sheet 4_UART.SchDoc: UART
size A4; ApprovedBy: Alcatraz; CheckedBy: Alcatraz; Author: Alcatraz; CompanyName: DHNLAB; DrawnBy: Alcatraz; Engineer: Alcatraz; Organization: DHNLAB PVT LTD; Address1: DHANBAD; Address2: JHARKHAND; Address3: INDIA; Address4: ASIA; DocumentNumber: 4; Revision: 1.0; SheetNumber: 4; SheetTotal: 10; ProjectTitle: ESP8266-Deskop_Power
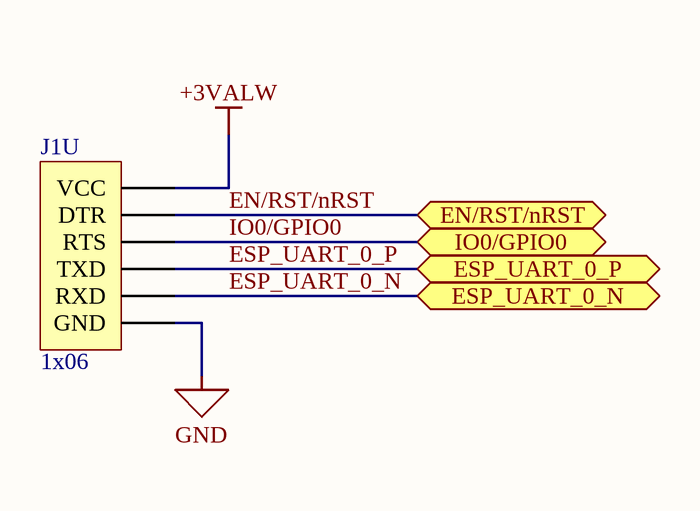
[diagram p3: 4_UART.SchDoc]

### Parts
J1U  1x06  [PinHeader_1x06_P2.54mm_Vertical_No_3D]

### Ports
EN/RST/nRST (bidir), ESP_UART_0_N (bidir, see 4_ESP32-Core[3B]), ESP_UART_0_P (bidir, see 4_ESP32-Core[3B]), IO0/GPIO0 (bidir)

### Nets
+3VALW: J1U.6(VCC)
GND: J1U.1(GND)
EN/RST/nRST: J1U.5(DTR) ; port EN/RST/nRST
ESP_UART_0_N: J1U.2(RXD) ; port ESP_UART_0_N
ESP_UART_0_P: J1U.3(TXD) ; port ESP_UART_0_P
IO0/GPIO0: J1U.4(RTS) ; port IO0/GPIO0

### Notes on the sheet
- Title:
- Author:
- Approved:
- Size:
- Date:
- Git Hash:
- A4
- Prj:
- SW Version:
- Variant:
- Edited:
- PUBLIC
- File:

### Library data of the parts
J1U = UART_1X06_P2.54mm_2

## Sheet 5_Keys_And_Status.SchDoc: KEYS AND STATUS
size A4; ApprovedBy: Alcatraz; CheckedBy: Alcatraz; Author: Alcatraz; CompanyName: DHNLAB; DrawnBy: Alcatraz; Engineer: Alcatraz; Organization: DHNLAB PVT LTD; Address1: DHANBAD; Address2: JHARKHAND; Address3: INDIA; Address4: ASIA; DocumentNumber: 5; Revision: 1.0; SheetNumber: 5; SheetTotal: 10; ProjectTitle: ESP8266-Deskop_Power
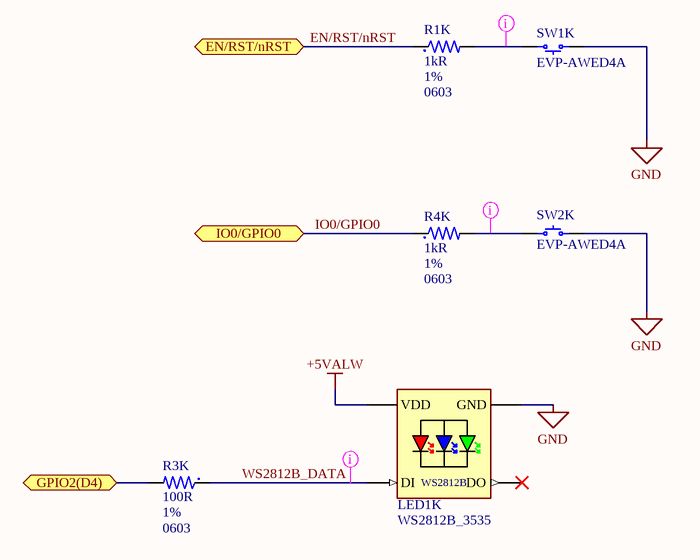
[diagram p4: 5_Keys_And_Status.SchDoc]

### Parts
LED1K  WS2812B_3535  [WS2812B-Mini_3535]
R1K  value 1kR  Tolerance: 1%  Case/Package: 0603  [R0603-MFG]  (hidden comment: RC0603FR-101KL)
R3K  value 100R  Tolerance: 1%  Case/Package: 0603  [R0603-MFG]  (hidden comment: AC0603FR-07100RL)
R4K  value 1kR  Tolerance: 1%  Case/Package: 0603  [R0603-MFG]  (hidden comment: RC0603FR-101KL)
SW1K  EVP-AWED4A  [PANASONIC EVPAW]
SW2K  EVP-AWED4A  [PANASONIC EVPAW]

### Ports
EN/RST/nRST (bidir), GPIO2(D4) (bidir, see 3_ESP8266_Core[2B]), IO0/GPIO0 (bidir)

### Nets
+5VALW: LED1K.1(VDD)
GND: LED1K.3(GND) SW1K.1 SW2K.2
EN/RST/nRST: R1K.1 ; port EN/RST/nRST
GPIO2(D4): R3K.2 ; port GPIO2(D4)
IO0/GPIO0: R4K.1 ; port IO0/GPIO0
WS2812B_DATA: LED1K.4(DI) R3K.1
NetR1K_2: R1K.2 SW1K.2
NetR4K_2: R4K.2 SW2K.1

Not connected (* = marked no-connect by the designer): LED1K 2(DO)*

### Layout directives
net class Digital_Signal_Low_Speed; net class Signal_75_ohm: NetR1K_2, NetR4K_2, WS2812B_DATA

### Notes on the sheet
- Title:
- Author:
- Approved:
- Size:
- Date:
- Git Hash:
- A4
- Prj:
- SW Version:
- Variant:
- Edited:
- PUBLIC
- File:

### Library data of the parts
LED1K = WS2812B_3535: 4 PIN SMART LED / WS2812 BODY 3.5MM X 3.5MM; MF: SparkFun Electronics; Availability: Unavailable; SnapEDA_Link: https://www.snapeda.com/parts/WS2812B/Worldsemi/view-part/1038297/?ref=snap; MP: WS2812B; Price: None; Value: *; Package: None
R1K R4K = 1K: SMD Chip Resistor, 1 kOhm, ± 1%, 100 mW, 0603 [1608 Metric], Thick Film, General Purpose; Manufacturer: Yageo; Power Rating: 100mW; Voltage Rating: 50V; Temperature Coefficient: 100ppm/°C; Supplier 1: Arrow Electronics; Manufacturer Part Number: RC0603FR-101KL; RoHS: Yes; Category: Chip SMD Resistors; Stock 1: 4; Pricing 1: 1=0.0018 (USD); Pins: 2NUMBER; Case Code (Metric): 1608; Case Code (Imperial): 0603; Contact Plating: Tin,Lead; Min Operating Temperature: -55°C; Max Operating Temperature: 155°C; Packaging: Tape and Reel; Resistor Type: Thick Film; Termination: SMD/SMT; Series: RC; Resistance Tolerance: 1%; Voltage Rating (DC): 50V; Length: 1.6mm; Width: 0.8mm; Height: 0.45mm; Reach SVHC Compliant: Unknown; RoHS Compliant: Yes; Supplier Part Number 1: RC0603FR-101KL; ComponentLink1URL: https://datasheet.ciiva.com/7983/443971-7983659.pdf?src-supplier=Element14; ComponentLink1Description: https://datasheet.ciiva.com/7983/443971-7983659.pdf?src-supplier=Element14; ComponentLink2URL: https://datasheet.ciiva.com/12560/rc0603-272842-12560633.pdf?src-supplier=Mouser; ComponentLink2Description: https://datasheet.ciiva.com/12560/rc0603-272842-12560633.pdf?src-supplier=Mouser
R3K = 100R: SMD Chip Resistor, 100 Ohm, ± 1%, 100 mW, 0603 [1608 Metric], Thick Film, General Purpose; Manufacturer: Yageo; Power Rating: 100mW; Voltage Rating: 50V; Temperature Coefficient: 100ppm/°C; Supplier 1: Future Electronics; Manufacturer Part Number: AC0603FR-07100RL; RoHS: Yes; Category: Chip SMD Resistors; Stock 1: 1675000; Pricing 1: 5000=0.0027, 50000=0.0025, 150000=0.0024, 375000=0.0023, 1000000=0.0022 (USD); Case Code (Metric): 1608; Contact Plating: Tin,Matte; Min Operating Temperature: -55°C; Max Operating Temperature: 155°C; Packaging: Tape and Reel; Height: 0.45mm; RoHS Compliant: Yes; ComponentLink1URL: https://datasheet.ciiva.com/12576/pyu-ac-51-rohs-l-2-12576586.pdf?src-supplier=Mouser; ComponentLink1Description: https://datasheet.ciiva.com/12576/pyu-ac-51-rohs-l-2-12576586.pdf?src-supplier=Mouser; Supplier Part Number 1: 2026405; Case Code (Imperial): 0603; Series: AC; Termination: SMD/SMT; Length: 1.6mm; Width: 0.8mm; Weight: 7.1E-05oz; Number of Terminations: 2; Max Power Dissipation: 100mW; Features: Moisture Resistant,Automotive AEC-Q200; Ratings: AEC-Q200; Lead Free: 5697LeadFree
SW1K SW2K = EVP-AWED4A: 3.0MM X 2.0MM / 3.3N / 0.15MM ST; Manufacturer: Panasonic Electronic Components; Actuator Height off PCB, Vertical: 0.60mm; Actuator Orientation: Top Actuated; Actuator Type: Standard; Circuit: SPST-NO; Contact Rating @ Voltage: 0.02A @ 15VDC; Illumination: Non-Illuminated; Ingress Protection: IP67 - Dust Tight, Waterproof; Operating Force: 330gf; Outline: 3.00mm x 2.00mm; Switch Function: Off-Mom; Part Number: EVP-AWED4A; ComponentLink1Description: Datasheet; ComponentLink1URL: https://industrial.panasonic.com/ac/cdn/e/control/switch/light-touch/catalog/sw_lt_eng_3020s.pdf; ComponentLink2Description: DigiKey Link; ComponentLink2URL: https://www.digikey.com/en/products/detail/panasonic-electronic-components/EVP-AWED4A/8568275; LastUpdated: 03-06-2024 20:19:31; Lifecycle Status: Active; Minimum Order: 1; Mounting Type: Surface Mount; Operating Temperature: -40°C ~ 85°C; Packaging: TapeAndReel; Part Status: Active; Price: 0.16; Series: EVPAW; Supplier 1: DigiKey; Supplier Part Number 1: P123440CT-ND; Termination Style: SMD (SMT) Tab

## Sheet 6_I2C_Sensors.SchDoc: I2C_Sensors
size A4; ApprovedBy: Alcatraz; CheckedBy: Alcatraz; Author: Alcatraz; CompanyName: DHNLAB; DrawnBy: Alcatraz; Engineer: Alcatraz; Organization: DHNLAB PVT LTD; Address1: DHANBAD; Address2: JHARKHAND; Address3: INDIA; Address4: ASIA; DocumentNumber: 6; Revision: 1.0; SheetNumber: 6; SheetTotal: 10; ProjectTitle: ESP8266-Deskop_Power
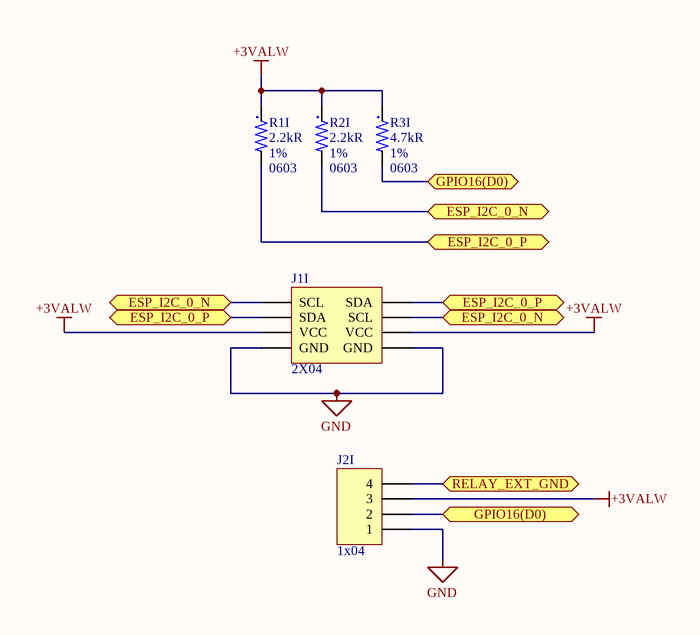
[diagram p5: 6_I2C_Sensors.SchDoc]

### Parts
J1I  2X04  [PinHeader_2x04_P2.54mm_Vertical]
J2I  1x04  [PinHeader_1x04_P2.54mm_Vertical]
R1I  value 2.2kR  Tolerance: 1%  Case/Package: 0603  [R0603-MFG]  (hidden comment: RC0603FR-072K2L)
R2I  value 2.2kR  Tolerance: 1%  Case/Package: 0603  [R0603-MFG]  (hidden comment: RC0603FR-072K2L)
R3I  value 4.7kR  Tolerance: 1%  Case/Package: 0603  [R0603-MFG]  (hidden comment: AC0603FR-074K7L)

### Ports
ESP_I2C_0_N (bidir, see 4_ESP32-Core[1C], 9_I2C & I2S[2A], 9_I2C & I2S[2B]), ESP_I2C_0_P (bidir, see 4_ESP32-Core[1C], 9_I2C & I2S[2A], 9_I2C & I2S[2B]), GPIO16(D0) (bidir, see 3_ESP8266_Core[4B]), RELAY_EXT_GND (bidir, see 3_ESP8266_Core[4B])

### Nets
+3VALW: J1I.3(VCC) J1I.4(VCC) J2I.3 R1I.1 R2I.1 R3I.1
GND: J1I.1(GND) J1I.2(GND) J2I.1
ESP_I2C_0_N: J1I.5(SCL) J1I.8(SCL) R2I.2 ; port ESP_I2C_0_N
ESP_I2C_0_P: J1I.6(SDA) J1I.7(SDA) R1I.2 ; port ESP_I2C_0_P
GPIO16(D0): J2I.2 R3I.2 ; port GPIO16(D0)
Relay_EXT_GND: J2I.4 ; port RELAY_EXT_GND

### Notes on the sheet
- Title:
- Author:
- Approved:
- Size:
- Date:
- Git Hash:
- A4
- Prj:
- SW Version:
- Variant:
- Edited:
- PUBLIC
- File:

### Library data of the parts
J1I = I2C_2X04_P2.54mm
J2I = PinHeader 1x04
R1I R2I = 2.2K: SMD Chip Resistor, 2.2 kOhm, ± 1%, 100 mW, 0603 [1608 Metric], Thick Film, General Purpose; Manufacturer: Yageo; Power Rating: 100mW; Voltage Rating: 50V; Temperature Coefficient: 100ppm/°C; Supplier 1: Future Electronics; Manufacturer Part Number: RC0603FR-072K2L; RoHS: Yes; Category: Chip SMD Resistors; Stock 1: 6755000; Pricing 1: 5000=0.0026, 75000=0.001, 100000=0.0024, 200000=0.001, 375000=0.0023, 500000=0.0009, 1250000=0.0022, 5000000=0.002 (USD); Case Code (Imperial): 0603; Case Code (Metric): 1608; Min Operating Temperature: -55°C; Max Operating Temperature: 155°C; Packaging: Tape and Reel; Resistor Type: Thick Film; Number of Terminations: 2; Max Power Dissipation: 100mW; Features: Moisture Resistant; Series: RC; Resistance Tolerance: 1%; Lead Free: Lead Free; RoHS Compliant: Yes; Reach SVHC Compliant: Unknown; ComponentLink1URL: https://datasheet.ciiva.com/2453/pyu-r-int-thick-7-2453943.pdf?src-supplier=Digikey; ComponentLink1Description: https://datasheet.ciiva.com/2453/pyu-r-int-thick-7-2453943.pdf?src-supplier=Digikey; ComponentLink2URL: https://datasheet.ciiva.com/2453/pyu-r-int-thick-7-2453944.pdf?src-supplier=Digikey; ComponentLink2Description: https://datasheet.ciiva.com/2453/pyu-r-int-thick-7-2453944.pdf?src-supplier=Digikey; ComponentLink3URL: https://datasheet.ciiva.com/2453/pyu-r-int-thick-7-2453945.pdf?src-supplier=Digikey; ComponentLink3Description: https://datasheet.ciiva.com/2453/pyu-r-int-thick-7-2453945.pdf?src-supplier=Digikey; ComponentLink4URL: https://datasheet.ciiva.com/7660/1868787-7660791.pdf?src-supplier=Element14; ComponentLink4Description: https://datasheet.ciiva.com/7660/1868787-7660791.pdf?src-supplier=Element14; ComponentLink5URL: https://datasheet.ciiva.com/46394/443971-46394958.pdf?src-supplier=Element14; ComponentLink5Description: https://datasheet.ciiva.com/46394/443971-46394958.pdf?src-supplier=Element14; Supplier Part Number 1: 6372452
R3I = 4.7K: SMD Chip Resistor, 4.7 kOhm, ± 1%, 100 mW, 0603 [1608 Metric], Thick Film, General Purpose; Manufacturer: Yageo; Power Rating: 100mW; Voltage Rating: 50V; Temperature Coefficient: 100ppm/°C; Supplier 1: Future Electronics; Manufacturer Part Number: AC0603FR-074K7L; RoHS: Yes; Category: Chip SMD Resistors; Stock 1: 3030000; Pricing 1: 5000=0.0033, 25000=0.0031, 125000=0.0029, 250000=0.0028, 750000=0.0026 (USD); Case Code (Imperial): 0603; Case Code (Metric): 1608; Min Operating Temperature: -55°C; Max Operating Temperature: 155°C; Packaging: Tape and Reel; Number of Terminations: 2; Max Power Dissipation: 100mW; Features: Moisture Resistant,Automotive AEC-Q200; Series: AC; Lead Free: Lead Free; RoHS Compliant: Yes; ComponentLink1URL: https://datasheet.octopart.com/AC0603FR-074K7L-Yageo-datasheet-166720450.pdf?src-supplier=Future+Electronics; ComponentLink1Description: https://datasheet.octopart.com/AC0603FR-074K7L-Yageo-datasheet-166720450.pdf?src-supplier=Future+Electronics; ComponentLink2URL: http://www.yageo.com/NewPortal/yageodocoutput?fileName=/pdf/R-Chip/PYu-AC_51_RoHS_L_6.pdf&src-supplier=Mouser; ComponentLink2Description: http://www.yageo.com/NewPortal/yageodocoutput?fileName=/pdf/R-Chip/PYu-AC_51_RoHS_L_6.pdf&src-supplier=Mouser; ComponentLink3URL: http://www.yageo.com/documents/recent/PYu-AC_51_RoHS_L_2_revised.pdf?src-supplier=Future+Electronics; ComponentLink3Description: http://www.yageo.com/documents/recent/PYu-AC_51_RoHS_L_2_revised.pdf?src-supplier=Future+Electronics; ComponentLink4URL: http://www.yageo.com/NewPortal/yageodocoutput?fileName=/pdf/R-Chip/PYu-AC_51_RoHS_L_6.pdf&src-supplier=TTI; ComponentLink4Description: http://www.yageo.com/NewPortal/yageodocoutput?fileName=/pdf/R-Chip/PYu-AC_51_RoHS_L_6.pdf&src-supplier=TTI; Supplier Part Number 1: 2029294; Termination: SMD/SMT; Ratings: AEC-Q200

## Sheet 7_Mosfets.SchDoc: Mosfets
size A4; ApprovedBy: Alcatraz; CheckedBy: Alcatraz; Author: Alcatraz; CompanyName: DHNLAB; DrawnBy: Alcatraz; Engineer: Alcatraz; Organization: DHNLAB PVT LTD; Address1: DHANBAD; Address2: JHARKHAND; Address3: INDIA; Address4: ASIA; DocumentNumber: 7; Revision: 1.0; SheetNumber: 7; SheetTotal: 10; ProjectTitle: ESP8266-Deskop_Power
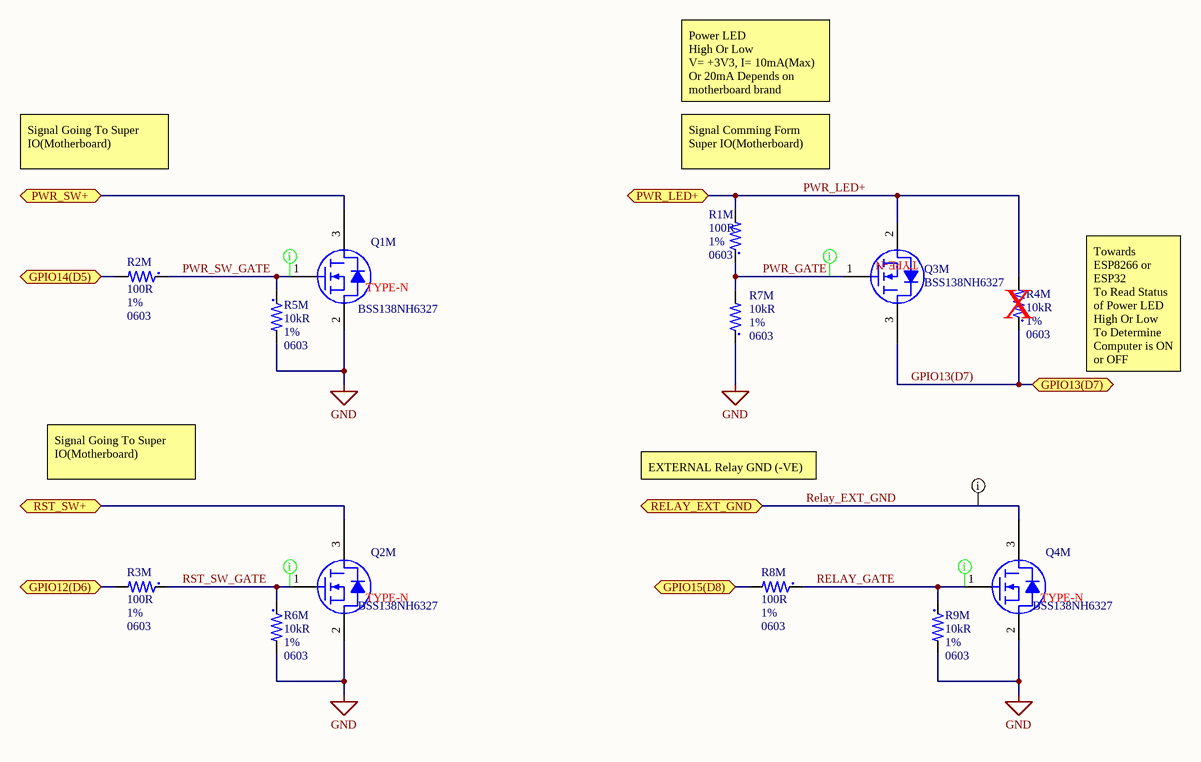
[diagram p6: 7_Mosfets.SchDoc]

### Parts
Q1M  BSS138NH6327  [SOT-23-3-IPC_C]
Q2M  BSS138NH6327  [SOT-23-3-IPC_C]
Q3M  BSS138NH6327  [SOT-23-3-IPC_C]
Q4M  BSS138NH6327  [SOT-23-3-IPC_C]
R1M  value 100R  Tolerance: 1%  Case/Package: 0603  [R0603-MFG]  (hidden comment: AC0603FR-07100RL)
R2M  value 100R  Tolerance: 1%  Case/Package: 0603  [R0603-MFG]  (hidden comment: AC0603FR-07100RL)
R3M  value 100R  Tolerance: 1%  Case/Package: 0603  [R0603-MFG]  (hidden comment: AC0603FR-07100RL)
R4M  value 10kR  Tolerance: 1%  Case/Package: 0603  [R0603-MFG]  (hidden comment: RC0603FR-0710KL)
R5M  value 10kR  Tolerance: 1%  Case/Package: 0603  [R0603-MFG]  (hidden comment: RC0603FR-0710KL)
R6M  value 10kR  Tolerance: 1%  Case/Package: 0603  [R0603-MFG]  (hidden comment: RC0603FR-0710KL)
R7M  value 10kR  Tolerance: 1%  Case/Package: 0603  [R0603-MFG]  (hidden comment: RC0603FR-0710KL)
R8M  value 100R  Tolerance: 1%  Case/Package: 0603  [R0603-MFG]  (hidden comment: AC0603FR-07100RL)
R9M  value 10kR  Tolerance: 1%  Case/Package: 0603  [R0603-MFG]  (hidden comment: RC0603FR-0710KL)

### Ports
GPIO12(D6) (bidir, see 3_ESP8266_Core[4B]), GPIO13(D7) (bidir, see 3_ESP8266_Core[4B]), GPIO14(D5) (bidir, see 3_ESP8266_Core[4B]), GPIO15(D8) (bidir, see 3_ESP8266_Core[2B]), PWR_LED+ (bidir, see 3_ESP8266_Core[4B]), PWR_SW+ (bidir, see 3_ESP8266_Core[4B]), RELAY_EXT_GND (bidir, see 3_ESP8266_Core[4B]), RST_SW+ (bidir, see 3_ESP8266_Core[4B])

### Nets
GND: Q1M.2(S) Q2M.2(S) Q4M.2(S) R5M.2 R6M.2 R7M.1 R9M.2
GPIO12(D6): R3M.2 ; port GPIO12(D6)
GPIO13(D7): Q3M.3(D) R4M.1 ; port GPIO13(D7)
GPIO14(D5): R2M.2 ; port GPIO14(D5)
GPIO15(D8): R8M.2 ; port GPIO15(D8)
PWR_GATE: Q3M.1(G) R1M.1 R7M.2
PWR_LED+: Q3M.2(S) R1M.2 R4M.2 ; port PWR_LED+
PWR_SW+: Q1M.3(D) ; port PWR_SW+
PWR_SW_GATE: Q1M.1(G) R2M.1 R5M.1
Relay_EXT_GND: Q4M.3(D) ; port RELAY_EXT_GND
RELAY_GATE: Q4M.1(G) R8M.1 R9M.1
RST_SW+: Q2M.3(D) ; port RST_SW+
RST_SW_GATE: Q2M.1(G) R3M.1 R6M.1

### Layout directives
net class Digital_Signal_Low_Speed; net class Signal: PWR_GATE, PWR_SW_GATE, RELAY_GATE, RST_SW_GATE
net class GND; net class PowerRails_GND: Relay_EXT_GND

### Notes on the sheet
- Power LED
  High Or Low
  V= +3V3, I= 10mA(Max) Or 20mA Depends on motherboard brand
- Signal Going To Super IO(Motherboard)
- Signal Comming Form Super IO(Motherboard)
- (near R4M) X
- Towards ESP8266 or ESP32
  To Read Status
  of Power LED
  High Or Low
  To Determine
  Computer is ON or OFF
- EXTERNAL Relay GND (-VE)
- Title:
- Author:
- Approved:
- Size:
- Date:
- Git Hash:
- A4
- Prj:
- SW Version:
- Variant:
- Edited:
- PUBLIC
- File:
- (in symbol BSS138NH6327) TYPE-N

### Library data of the parts
Q1M Q2M Q3M Q4M = BSS138NH6327: Single N-Channel 60 V 3.5 Ohm 1 nC SIPMOS® Small Signal Mosfet - SOT-23; Manufacturer: Infineon; Rds On Max: 3.5R; Continuous Drain Current (ID): 230mA; Max Power Dissipation: 360mW; Input Capacitance: 41pF; Drain to Source Voltage (Vdss): 60V; Turn-Off Delay Time: 6.7ns; Turn-On Delay Time: 2.3ns; Threshold Voltage: 1V; Gate to Source Voltage (Vgs): 20V; Voltage: 50V; Rise Time: 3ns; Fall Time: 8.2ns; Supplier 1: Mouser; Manufacturer Part Number: BSS138NH6327; RoHS: Yes; Stock 1: 795876; Pricing 1: 1=0.37, 10=0.281, 50=0.281, 100=0.159, 1000=0.081, 10000=0.056 (USD); Mounting Technology: Surface Mount; Case/Package: TO-236-3; Pins: 3; Min Operating Temperature: -55°C; Max Operating Temperature: 150°C; Packaging: Tape and Reel; Package Quantity: 3000; Series: SIPMOS®; Length: 2.9mm; Width: 1.3mm; Height: 1mm; RoHS Compliant: Yes; Reach SVHC Compliant: No; Supplier Part Number 1: 726-BSS138NH6327
R1M R2M R3M R8M = 100R: as R3K on sheet 5_Keys_And_Status; Supplier 1: Future Electronics; Manufacturer Part Number: AC0603FR-07100RL; RoHS: Yes; Category: Chip SMD Resistors; Stock 1: 1675000; Pricing 1: 5000=0.0027, 50000=0.0025, 150000=0.0024, 375000=0.0023, 1000000=0.0022 (USD); Case Code (Metric): 1608; Min Operating Temperature: -55°C; Max Operating Temperature: 155°C; Packaging: Tape and Reel; Height: 0.45mm; RoHS Compliant: Yes; ComponentLink1URL: https://datasheet.ciiva.com/12576/pyu-ac-51-rohs-l-2-12576586.pdf?src-supplier=Mouser; ComponentLink1Description: https://datasheet.ciiva.com/12576/pyu-ac-51-rohs-l-2-12576586.pdf?src-supplier=Mouser; Supplier Part Number 1: 2026405; Contact Plating: Tin,Matte; Case Code (Imperial): 0603; Series: AC; Termination: SMD/SMT; Length: 1.6mm; Width: 0.8mm; Weight: 7.1E-05oz; Number of Terminations: 2; Max Power Dissipation: 100mW; Features: Moisture Resistant,Automotive AEC-Q200; Ratings: AEC-Q200; Lead Free: 5697LeadFree
R4M R7M = 10K: SMD Chip Resistor, 10 kOhm, ± 1%, 100 mW, 0603 [1608 Metric], Thick Film, General Purpose; Manufacturer: Yageo; Power Rating: 100mW; Voltage Rating: 75V; Temperature Coefficient: 100ppm/°C; Voltage Rating (DC): 50V; Supplier 1: Future Electronics; Manufacturer Part Number: RC0603FR-0710KL; RoHS: Yes; Category: Chip SMD Resistors; Stock 1: 44660000; Pricing 1: 5000=0.0015, 50000=0.0014, 150000=0.0014, 375000=0.0013, 1000000=0.0012 (USD); Case Code (Metric): 1608; Min Operating Temperature: -55°C; Max Operating Temperature: 155°C; Packaging: Tape and Reel; Height: 0.45mm; RoHS Compliant: Yes; Supplier Part Number 1: 4023214; Lead Free: 5697LeadFree; Case Code (Imperial): 0603; Series: RC; Termination: SMD/SMT; Construction: Rectangular; Length: 1.6mm; Width: 0.8mm; Depth: 0.8mm; Military Standard: Not; Pins: 2; Weight: 7.1E-05oz; Resistance Tolerance: 1%; Resistor Type: Thick Film; Max Power Dissipation: 100mW; Features: Moisture Resistant; Number of Terminations: 2; Lead Pitch: 0.3mm; Reach SVHC Compliant: No
R5M R6M R9M = 10K: as R1L on sheet 2_LDO; Supplier 1: Future Electronics; Manufacturer Part Number: RC0603FR-0710KL; RoHS: Yes; Category: Chip SMD Resistors; Stock 1: 44660000; Pricing 1: 5000=0.0015, 50000=0.0014, 150000=0.0014, 375000=0.0013, 1000000=0.0012 (USD); Case Code (Imperial): 0603; Case Code (Metric): 1608; Min Operating Temperature: -55°C; Max Operating Temperature: 155°C; Packaging: Tape and Reel; Series: RC; Termination: SMD/SMT; Construction: Rectangular; Length: 1.6mm; Width: 0.8mm; Height: 0.45mm; Depth: 0.8mm; RoHS Compliant: Yes; Military Standard: Not; Lead Free: 5697LeadFree; Supplier Part Number 1: 4023214; Pins: 2; Weight: 7.1E-05oz; Resistance Tolerance: 1%; Resistor Type: Thick Film; Max Power Dissipation: 100mW; Features: Moisture Resistant; Number of Terminations: 2; Lead Pitch: 0.3mm; Reach SVHC Compliant: No